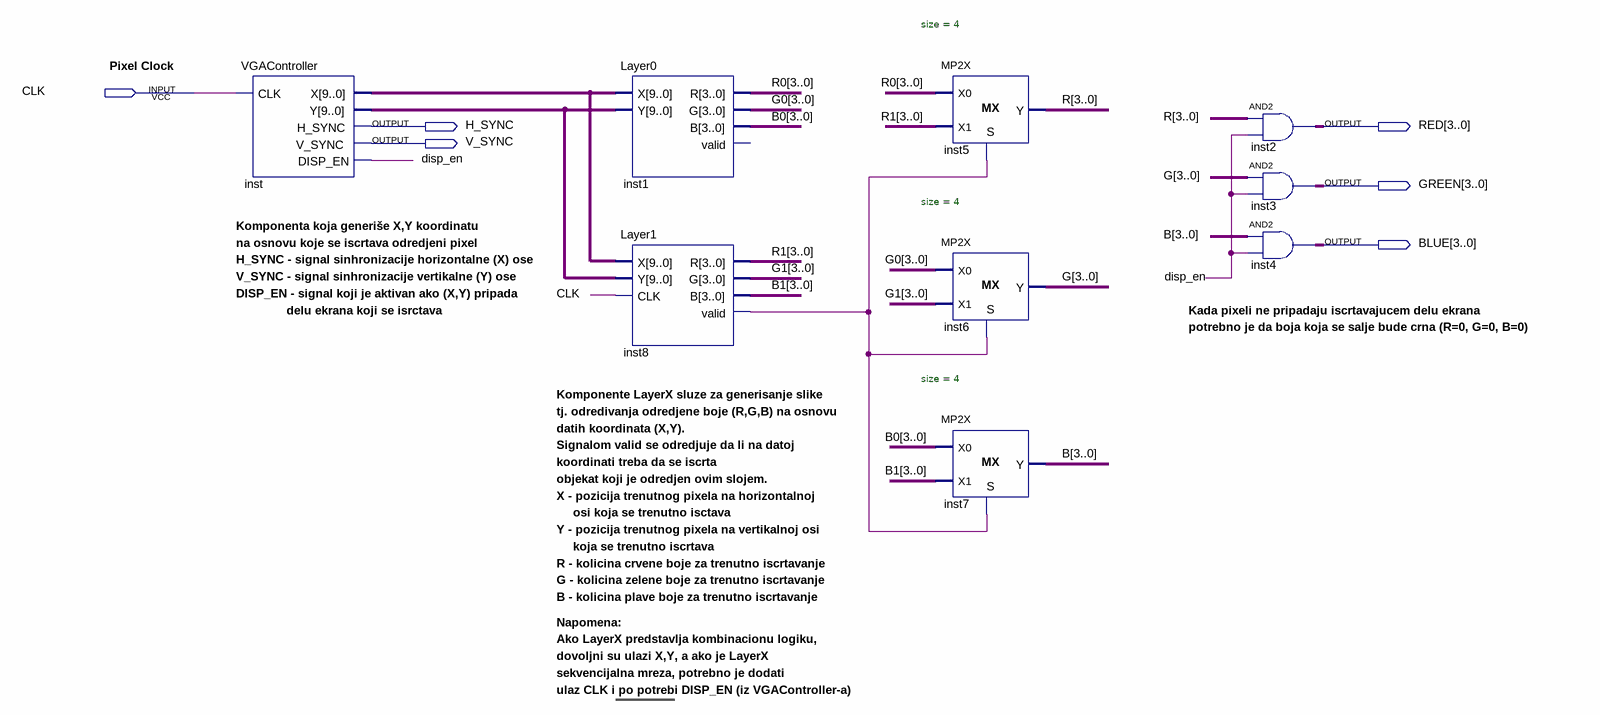
[diagram p0: schematic sheet]
// Quartus schematic Lab2Demo.bdf as structural Verilog: 9 symbols, 6 pins
module Lab2Demo (
  input  CLK,
  output H_SYNC,
  output [3:0] RED,
  output V_SYNC,
  output [3:0] GREEN,
  output [3:0] BLUE
);

  wire disp_en, inst8_valid;
  wire [3:0] B, B0, B1, G, G0, G1, R, R0, R1;
  wire [9:0] inst_x, inst_y;

  VGAController inst (.CLK(CLK), .X(inst_x), .Y(inst_y), .H_SYNC(H_SYNC), .V_SYNC(V_SYNC), .DISP_EN(disp_en));
  Layer0 inst1 (.X(inst_x), .Y(inst_y), .R(R0), .G(G0), .B(B0));  // open: valid
  Layer1 inst8 (.X(inst_x), .Y(inst_y), .CLK(CLK), .R(R1), .G(G1), .B(B1), .valid(inst8_valid));
  MP2X #(.size(4)) inst5 (.S(inst8_valid), .X0(R0), .X1(R1), .Y(R));
  MP2X #(.size(4)) inst6 (.S(inst8_valid), .X0(G0), .X1(G1), .Y(G));
  MP2X #(.size(4)) inst7 (.S(inst8_valid), .X0(B0), .X1(B1), .Y(B));
  assign RED = R & {4{disp_en}};  // AND2 inst2, 4 bits wide
  assign GREEN = G & {4{disp_en}};  // AND2 inst3, 4 bits wide
  assign BLUE = B & {4{disp_en}};  // AND2 inst4, 4 bits wide

  // Notes on the sheet:
  //   Pixel Clock
  //   Komponenta koja generiše X,Y koordinatu
  //   na osnovu koje se iscrtava odredjeni pixel
  //   H_SYNC - signal sinhronizacije horizontalne (X) ose
  //   V_SYNC - signal sinhronizacije vertikalne (Y) ose
  //   DISP_EN - signal koji je aktivan ako (X,Y) pripada
  //   delu ekrana koji se isrctava
  //   Kada pixeli ne pripadaju iscrtavajucem delu ekrana
  //   potrebno je da boja koja se salje bude crna (R=0, G=0, B=0)
  //   Komponente LayerX sluze za generisanje slike
  //   tj. odredivanja odredjene boje (R,G,B) na osnovu 
  //   datih koordinata (X,Y). 
  //   Signalom valid se odredjuje da li na datoj 
  //   koordinati treba da se iscrta
  //   objekat koji je odredjen ovim slojem.
  //   X - pozicija trenutnog pixela na horizontalnoj 
  //   osi koja se trenutno isctava
  //   Y - pozicija trenutnog pixela na vertikalnoj osi
  //   koja se trenutno iscrtava
  //   R - kolicina crvene boje za trenutno iscrtavanje
  //   G - kolicina zelene boje za trenutno iscrtavanje
  //   B - kolicina plave boje za trenutno iscrtavanje
  //   Napomena:
  //   Ako LayerX predstavlja kombinacionu logiku,
  //   dovoljni su ulazi X,Y, a ako je LayerX
  //   sekvencijalna mreza, potrebno je dodati
  //   ulaz CLK i po potrebi DISP_EN (iz VGAController-a)
endmodule
